# Altium schematic sheet 06_FPGA_SOC_Part2.SchDoc
size A3; SheetNumber: 6; SheetTotal: 8
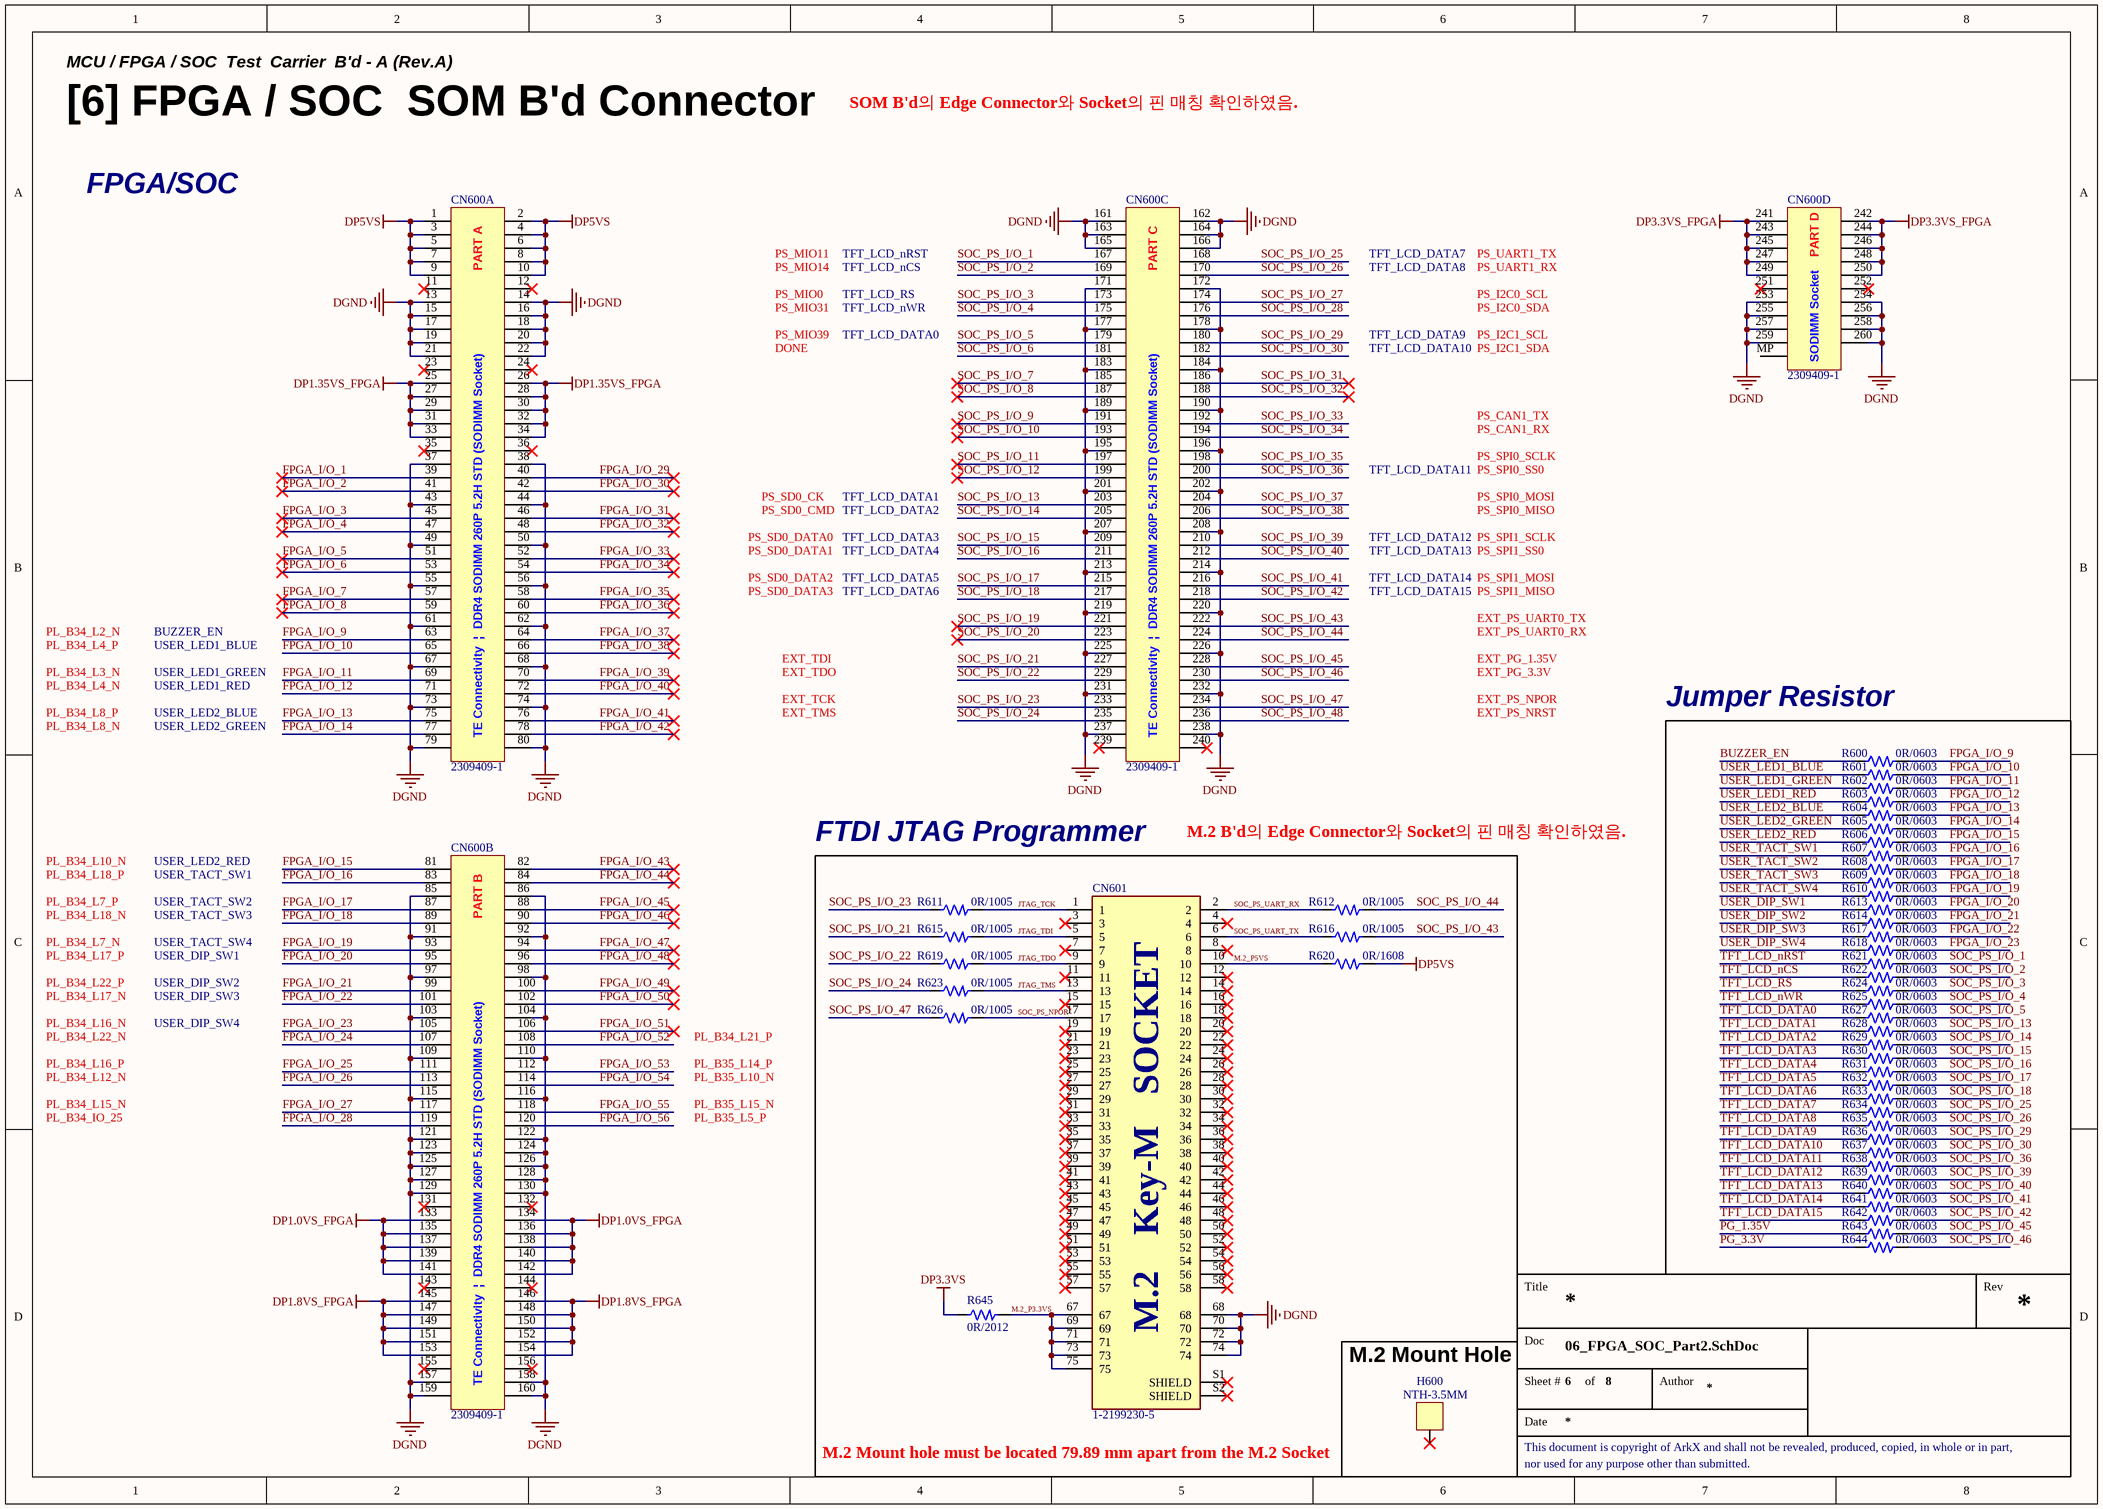
[diagram p0: 06_FPGA_SOC_Part2.SchDoc]

## Parts
CN600  2309409-1  [CON_SODIMM_2309409-1]  (parts A,B,C,D of 4)
CN601  1-2199230-5  [CON_M.2-KEY-M_FEMALE_1-2199230-5]
H600  NTH-3.5MM  [HOLE_NTH-3.5MM]
R600  0R/0603  [RES 0603 (0201_inch)]
R601  0R/0603  [RES 0603 (0201_inch)]
R602  0R/0603  [RES 0603 (0201_inch)]
R603  0R/0603  [RES 0603 (0201_inch)]
R604  0R/0603  [RES 0603 (0201_inch)]
R605  0R/0603  [RES 0603 (0201_inch)]
R606  0R/0603  [RES 0603 (0201_inch)]
R607  0R/0603  [RES 0603 (0201_inch)]
R608  0R/0603  [RES 0603 (0201_inch)]
R609  0R/0603  [RES 0603 (0201_inch)]
R610  0R/0603  [RES 0603 (0201_inch)]
R611  0R/1005  [RES 1005 (0402_inch)]
R612  0R/1005  [RES 1005 (0402_inch)]
R613  0R/0603  [RES 0603 (0201_inch)]
R614  0R/0603  [RES 0603 (0201_inch)]
R615  0R/1005  [RES 1005 (0402_inch)]
R616  0R/1005  [RES 1005 (0402_inch)]
R617  0R/0603  [RES 0603 (0201_inch)]
R618  0R/0603  [RES 0603 (0201_inch)]
R619  0R/1005  [RES 1005 (0402_inch)]
R620  0R/1608  [RES 1608 (0603_inch)]
R621  0R/0603  [RES 0603 (0201_inch)]
R622  0R/0603  [RES 0603 (0201_inch)]
R623  0R/1005  [RES 1005 (0402_inch)]
R624  0R/0603  [RES 0603 (0201_inch)]
R625  0R/0603  [RES 0603 (0201_inch)]
R626  0R/1005  [RES 1005 (0402_inch)]
R627  0R/0603  [RES 0603 (0201_inch)]
R628  0R/0603  [RES 0603 (0201_inch)]
R629  0R/0603  [RES 0603 (0201_inch)]
R630  0R/0603  [RES 0603 (0201_inch)]
R631  0R/0603  [RES 0603 (0201_inch)]
R632  0R/0603  [RES 0603 (0201_inch)]
R633  0R/0603  [RES 0603 (0201_inch)]
R634  0R/0603  [RES 0603 (0201_inch)]
R635  0R/0603  [RES 0603 (0201_inch)]
R636  0R/0603  [RES 0603 (0201_inch)]
R637  0R/0603  [RES 0603 (0201_inch)]
R638  0R/0603  [RES 0603 (0201_inch)]
R639  0R/0603  [RES 0603 (0201_inch)]
R640  0R/0603  [RES 0603 (0201_inch)]
R641  0R/0603  [RES 0603 (0201_inch)]
R642  0R/0603  [RES 0603 (0201_inch)]
R643  0R/0603  [RES 0603 (0201_inch)]
R644  0R/0603  [RES 0603 (0201_inch)]
R645  0R/2012  [RES 2012 (0805_inch)]

## Blocks framed on the sheet
Jumper Resistor: R600-R610 R613 R614 R617 R618 R621 R622 R624 R625 R627-R644
FTDI JTAG Programmer: CN601 R611 R612 R615 R616 R619 R620 R623 R626 R645
M.2 Mount Hole: H600

## Nets
DGND: CN600.13 CN600.14 CN600.15 CN600.16 CN600.17 CN600.18 CN600.19 CN600.20 CN600.21 CN600.22 CN600.37 CN600.38 CN600.43 CN600.44 CN600.49 CN600.50 CN600.55 CN600.56 CN600.61 CN600.62 CN600.67 CN600.68 CN600.73 CN600.74 CN600.79 CN600.80 CN600.85 CN600.86 CN600.91 CN600.92 CN600.97 CN600.98 CN600.103 CN600.104 CN600.109 CN600.110 CN600.115 CN600.116 CN600.121 CN600.122 CN600.123 CN600.124 CN600.125 CN600.126 CN600.127 CN600.128 CN600.129 CN600.130 CN600.157 CN600.158 CN600.159 CN600.160 CN600.161 CN600.162 CN600.163 CN600.164 CN600.165 CN600.166 CN600.171 CN600.172 CN600.177 CN600.178 CN600.183 CN600.184 CN600.189 CN600.190 CN600.195 CN600.196 CN600.201 CN600.202 CN600.207 CN600.208 CN600.213 CN600.214 CN600.219 CN600.220 CN600.225 CN600.226 CN600.231 CN600.232 CN600.237 CN600.238 CN600.253 CN600.254 CN600.255 CN600.256 CN600.257 CN600.258 CN600.259 CN600.260 CN601.68 CN601.70 CN601.72 CN601.74
DP1.0VS_FPGA: CN600.133 CN600.134 CN600.135 CN600.136 CN600.137 CN600.138 CN600.139 CN600.140 CN600.141 CN600.142
DP1.8VS_FPGA: CN600.145 CN600.146 CN600.147 CN600.148 CN600.149 CN600.150 CN600.151 CN600.152 CN600.153 CN600.154
DP1.35VS_FPGA: CN600.25 CN600.26 CN600.27 CN600.28 CN600.29 CN600.30 CN600.31 CN600.32 CN600.33 CN600.34
DP3.3VS: R645.1
DP3.3VS_FPGA: CN600.241 CN600.242 CN600.243 CN600.244 CN600.245 CN600.246 CN600.247 CN600.248 CN600.249 CN600.250
DP5VS: CN600.1 CN600.2 CN600.3 CN600.4 CN600.5 CN600.6 CN600.7 CN600.8 CN600.9 CN600.10 R620.2
BUZZER_EN: R600.1
FPGA_I/O_1: CN600.39
FPGA_I/O_2: CN600.41
FPGA_I/O_3: CN600.45
FPGA_I/O_4: CN600.47
FPGA_I/O_5: CN600.51
FPGA_I/O_6: CN600.53
FPGA_I/O_7: CN600.57
FPGA_I/O_8: CN600.59
FPGA_I/O_9: CN600.63 R600.2
FPGA_I/O_10: CN600.65 R601.2
FPGA_I/O_11: CN600.69 R602.2
FPGA_I/O_12: CN600.71 R603.2
FPGA_I/O_13: CN600.75 R604.2
FPGA_I/O_14: CN600.77 R605.2
FPGA_I/O_15: CN600.81 R606.2
FPGA_I/O_16: CN600.83 R607.2
FPGA_I/O_17: CN600.87 R608.2
FPGA_I/O_18: CN600.89 R609.2
FPGA_I/O_19: CN600.93 R610.2
FPGA_I/O_20: CN600.95 R613.2
FPGA_I/O_21: CN600.99 R614.2
FPGA_I/O_22: CN600.101 R617.2
FPGA_I/O_23: CN600.105 R618.2
FPGA_I/O_24: CN600.107
FPGA_I/O_25: CN600.111
FPGA_I/O_26: CN600.113
FPGA_I/O_27: CN600.117
FPGA_I/O_28: CN600.119
FPGA_I/O_29: CN600.40
FPGA_I/O_30: CN600.42
FPGA_I/O_31: CN600.46
FPGA_I/O_32: CN600.48
FPGA_I/O_33: CN600.52
FPGA_I/O_34: CN600.54
FPGA_I/O_35: CN600.58
FPGA_I/O_36: CN600.60
FPGA_I/O_37: CN600.64
FPGA_I/O_38: CN600.66
FPGA_I/O_39: CN600.70
FPGA_I/O_40: CN600.72
FPGA_I/O_41: CN600.76
FPGA_I/O_42: CN600.78
FPGA_I/O_43: CN600.82
FPGA_I/O_44: CN600.84
FPGA_I/O_45: CN600.88
FPGA_I/O_46: CN600.90
FPGA_I/O_47: CN600.94
FPGA_I/O_48: CN600.96
FPGA_I/O_49: CN600.100
FPGA_I/O_50: CN600.102
FPGA_I/O_51: CN600.106
FPGA_I/O_52: CN600.108
FPGA_I/O_53: CN600.112
FPGA_I/O_54: CN600.114
FPGA_I/O_55: CN600.118
FPGA_I/O_56: CN600.120
JTAG_TCK: CN601.1 R611.2
JTAG_TDI: CN601.5 R615.2
JTAG_TDO: CN601.9 R619.2
JTAG_TMS: CN601.13 R623.2
M.2_P3.3VS: CN601.67 CN601.69 CN601.71 CN601.73 CN601.75 R645.2
M.2_P5VS: CN601.10 R620.1
PG_1.35V: R643.1
PG_3.3V: R644.1
SOC_PS_I/O_1: CN600.167 R621.2
SOC_PS_I/O_2: CN600.169 R622.2
SOC_PS_I/O_3: CN600.173 R624.2
SOC_PS_I/O_4: CN600.175 R625.2
SOC_PS_I/O_5: CN600.179 R627.2
SOC_PS_I/O_6: CN600.181
SOC_PS_I/O_7: CN600.185
SOC_PS_I/O_8: CN600.187
SOC_PS_I/O_9: CN600.191
SOC_PS_I/O_10: CN600.193
SOC_PS_I/O_11: CN600.197
SOC_PS_I/O_12: CN600.199
SOC_PS_I/O_13: CN600.203 R628.2
SOC_PS_I/O_14: CN600.205 R629.2
SOC_PS_I/O_15: CN600.209 R630.2
SOC_PS_I/O_16: CN600.211 R631.2
SOC_PS_I/O_17: CN600.215 R632.2
SOC_PS_I/O_18: CN600.217 R633.2
SOC_PS_I/O_19: CN600.221
SOC_PS_I/O_20: CN600.223
SOC_PS_I/O_21: CN600.227 R615.1
SOC_PS_I/O_22: CN600.229 R619.1
SOC_PS_I/O_23: CN600.233 R611.1
SOC_PS_I/O_24: CN600.235 R623.1
SOC_PS_I/O_25: CN600.168 R634.2
SOC_PS_I/O_26: CN600.170 R635.2
SOC_PS_I/O_27: CN600.174
SOC_PS_I/O_28: CN600.176
SOC_PS_I/O_29: CN600.180 R636.2
SOC_PS_I/O_30: CN600.182 R637.2
SOC_PS_I/O_31: CN600.186
SOC_PS_I/O_32: CN600.188
SOC_PS_I/O_33: CN600.192
SOC_PS_I/O_34: CN600.194
SOC_PS_I/O_35: CN600.198
SOC_PS_I/O_36: CN600.200 R638.2
SOC_PS_I/O_37: CN600.204
SOC_PS_I/O_38: CN600.206
SOC_PS_I/O_39: CN600.210 R639.2
SOC_PS_I/O_40: CN600.212 R640.2
SOC_PS_I/O_41: CN600.216 R641.2
SOC_PS_I/O_42: CN600.218 R642.2
SOC_PS_I/O_43: CN600.222 R616.2
SOC_PS_I/O_44: CN600.224 R612.2
SOC_PS_I/O_45: CN600.228 R643.2
SOC_PS_I/O_46: CN600.230 R644.2
SOC_PS_I/O_47: CN600.234 R626.1
SOC_PS_I/O_48: CN600.236
SOC_PS_NPOR: CN601.17 R626.2
SOC_PS_UART_RX: CN601.2 R612.1
SOC_PS_UART_TX: CN601.6 R616.1
TFT_LCD_DATA0: R627.1
TFT_LCD_DATA1: R628.1
TFT_LCD_DATA2: R629.1
TFT_LCD_DATA3: R630.1
TFT_LCD_DATA4: R631.1
TFT_LCD_DATA5: R632.1
TFT_LCD_DATA6: R633.1
TFT_LCD_DATA7: R634.1
TFT_LCD_DATA8: R635.1
TFT_LCD_DATA9: R636.1
TFT_LCD_DATA10: R637.1
TFT_LCD_DATA11: R638.1
TFT_LCD_DATA12: R639.1
TFT_LCD_DATA13: R640.1
TFT_LCD_DATA14: R641.1
TFT_LCD_DATA15: R642.1
TFT_LCD_nCS: R622.1
TFT_LCD_nRST: R621.1
TFT_LCD_nWR: R625.1
TFT_LCD_RS: R624.1
USER_DIP_SW1: R613.1
USER_DIP_SW2: R614.1
USER_DIP_SW3: R617.1
USER_DIP_SW4: R618.1
USER_LED1_BLUE: R601.1
USER_LED1_GREEN: R602.1
USER_LED1_RED: R603.1
USER_LED2_BLUE: R604.1
USER_LED2_GREEN: R605.1
USER_LED2_RED: R606.1
USER_TACT_SW1: R607.1
USER_TACT_SW2: R608.1
USER_TACT_SW3: R609.1
USER_TACT_SW4: R610.1

Not connected (* = marked no-connect by the designer): CN600 11* 12* 23* 24* 35* 36* 131* 132* 143* 144* 155* 156* 239* 240* 251* 252* MP; CN601 3* 4* 7* 8* 11* 12* 14* 15* 16* 18* 19* 20* 21* 22* 23* 24* 25* 26* 27* 28* 29* 30* 31* 32* 33* 34* 35* 36* 37* 38* 39* 40* 41* 42* 43* 44* 45* 46* 47* 48* 49* 50* 51* 52* 53* 54* 55* 56* 57* 58* S1(SHIELD)* S2(SHIELD)*; H600 1*

## Notes on the sheet
- MCU / FPGA / SOC  Test  Carrier  B'd - A (Rev.A)
- SOM B'd의 Edge Connector와 Socket의 핀 매칭 확인하였음.
- [6] FPGA / SOC  SOM B'd Connector
- FPGA/SOC
- PS_MIO11
- PS_MIO14
- PS_MIO0
- PS_MIO31
- TFT_LCD_nRST
- TFT_LCD_nCS
- TFT_LCD_RS
- TFT_LCD_nWR
- TFT_LCD_DATA7
- TFT_LCD_DATA8
- PS_UART1_TX
- PS_UART1_RX
- PS_I2C0_SCL
- PS_I2C0_SDA
- PS_MIO39
- DONE
- TFT_LCD_DATA0
- TFT_LCD_DATA9
- TFT_LCD_DATA10
- PS_I2C1_SCL
- PS_I2C1_SDA
- PS_CAN1_TX
- PS_CAN1_RX
- PS_SD0_CK
- PS_SD0_CMD
- TFT_LCD_DATA1
- TFT_LCD_DATA2
- TFT_LCD_DATA11
- PS_SPI0_SCLK
- PS_SPI0_SS0
- PS_SPI0_MOSI
- PS_SPI0_MISO
- PS_SD0_DATA0
- PS_SD0_DATA1
- PS_SD0_DATA2
- TFT_LCD_DATA3
- TFT_LCD_DATA4
- TFT_LCD_DATA5
- TFT_LCD_DATA12
- TFT_LCD_DATA13
- TFT_LCD_DATA14
- PS_SPI1_SCLK
- PS_SPI1_SS0
- PS_SPI1_MOSI
- PL_B34_L2_N
- PL_B34_L4_P
- BUZZER_EN
- USER_LED1_BLUE
- PS_SD0_DATA3
- TFT_LCD_DATA6
- TFT_LCD_DATA15
- PS_SPI1_MISO
- EXT_PS_UART0_TX
- EXT_PS_UART0_RX
- PL_B34_L3_N
- PL_B34_L4_N
- PL_B34_L8_P
- USER_LED1_GREEN
- USER_LED1_RED
- USER_LED2_BLUE
- EXT_TDI
- EXT_TDO
- EXT_TCK
- EXT_TMS
- EXT_PG_1.35V
- EXT_PG_3.3V
- EXT_PS_NPOR
- EXT_PS_NRST
- PL_B34_L8_N
- USER_LED2_GREEN
- M.2 B'd의 Edge Connector와 Socket의 핀 매칭 확인하였음.
- PL_B34_L10_N
- PL_B34_L18_P
- PL_B34_L7_P
- PL_B34_L18_N
- USER_LED2_RED
- USER_TACT_SW1
- USER_TACT_SW2
- USER_TACT_SW3
- PL_B34_L7_N
- PL_B34_L17_P
- PL_B34_L22_P
- USER_TACT_SW4
- USER_DIP_SW1
- USER_DIP_SW2
- PL_B34_L17_N
- PL_B34_L16_N
- PL_B34_L22_N
- USER_DIP_SW3
- USER_DIP_SW4
- PL_B34_L21_P
- PL_B34_L16_P
- PL_B34_L12_N
- PL_B34_L15_N
- PL_B34_IO_25
- PL_B35_L14_P
- PL_B35_L10_N
- PL_B35_L15_N
- PL_B35_L5_P
- M.2 Mount hole must be located 79.89 mm apart from the M.2 Socket
- Title
- Rev
- Doc
- Sheet #
- of
- Author
- This document is copyright of ArkX and shall not be revealed, produced, copied, in whole or in part,
- Date
- nor used for any purpose other than submitted.
- (in symbol CON_M.2-KEY-M_FEMALE_1-2199230-5) SOCKET; Key-M; M.2
- (in symbol CON_SODIMM_2309409-1, part A) PART A; TE Connectivity  |  DDR4 SODIMM 260P 5.2H STD (SODIMM Socket)
- (in symbol CON_SODIMM_2309409-1, part B) PART B; TE Connectivity  |  DDR4 SODIMM 260P 5.2H STD (SODIMM Socket)
- (in symbol CON_SODIMM_2309409-1, part C) PART C; TE Connectivity  |  DDR4 SODIMM 260P 5.2H STD (SODIMM Socket)
- (in symbol CON_SODIMM_2309409-1, part D) PART D; SODIMM Socket

## Library data of the parts
CN600 = CON_SODIMM_2309409-1: SO DIMM Socket, Small Outline (SO), Stack Height .205 in [5.2 mm], Right Angle Module Orientation, 260 Position, DDR4 DIMM; Manufacturer: TE Connectivity; Manufacturer Part Number: 2309409-1; JLCPCB Part Type: Extended Part; LCSC Part #: C5164025
CN601 = CON_M.2-KEY-M_FEMALE_1-2199230-5: M.2 NGFF Key M Card Edge Connector 0.5mm Pitch 67 Position 4.2mm Height; Manufacturer: TE Connectivity; Manufacturer Part Number: 1-2199230-5; Distributor Link: https://eu.mouser.com/ProductDetail/TE-Connectivity/1-2199230-5?qs=N0TJGnUfxCD5L9UvFjPEwQ%3D%3D; LCSC Part #: C590854; JLCPCB Part Type: Extended Part
H600 = HOLE_NTH-3.5MM: Non-Through Hole 3.5mm
R600-R610 R613 R614 R617 R618 R621 R622 R624 R625 R627-R644 = RES_0R/0603/50mW: 50mW Thick Film Resistors 25V ±1% 0Ω 0201  Chip Resistor - Surface Mount ROHS; Value: 0R; Size: 0603; Power Rating: 50mW; Precision: 1%; LCSC Part #: C106227; JLCPCB Part Type: Extended Part
R611 R612 R615 R616 R619 R623 R626 = RES_0R/1005/62.5mW: Value: 0R; Power Rating: 62.5mW; Precision: 1%; Size: 1005; LCSC Part #: C17168; JLCPCB Part Type: Basic Part
R620 = RES_0R/1608/0.1W: Value: 0R; Power Rating: 0.1W; Precision: 1%; Size: 1608; LCSC Part #: C21189; JLCPCB Part Type: Basic Part
R645 = RES_0R/2012/0.125W: Value: 0R; Power Rating: 0.125W; Precision: 1%; Size: 2012; LCSC Part #: C17477; JLCPCB Part Type: Basic Part